# Altium schematic sheet digital_PIN_interface.SchDoc (part 1 of 2)
size C portrait; SheetNumber: 2; SheetTotal: 2
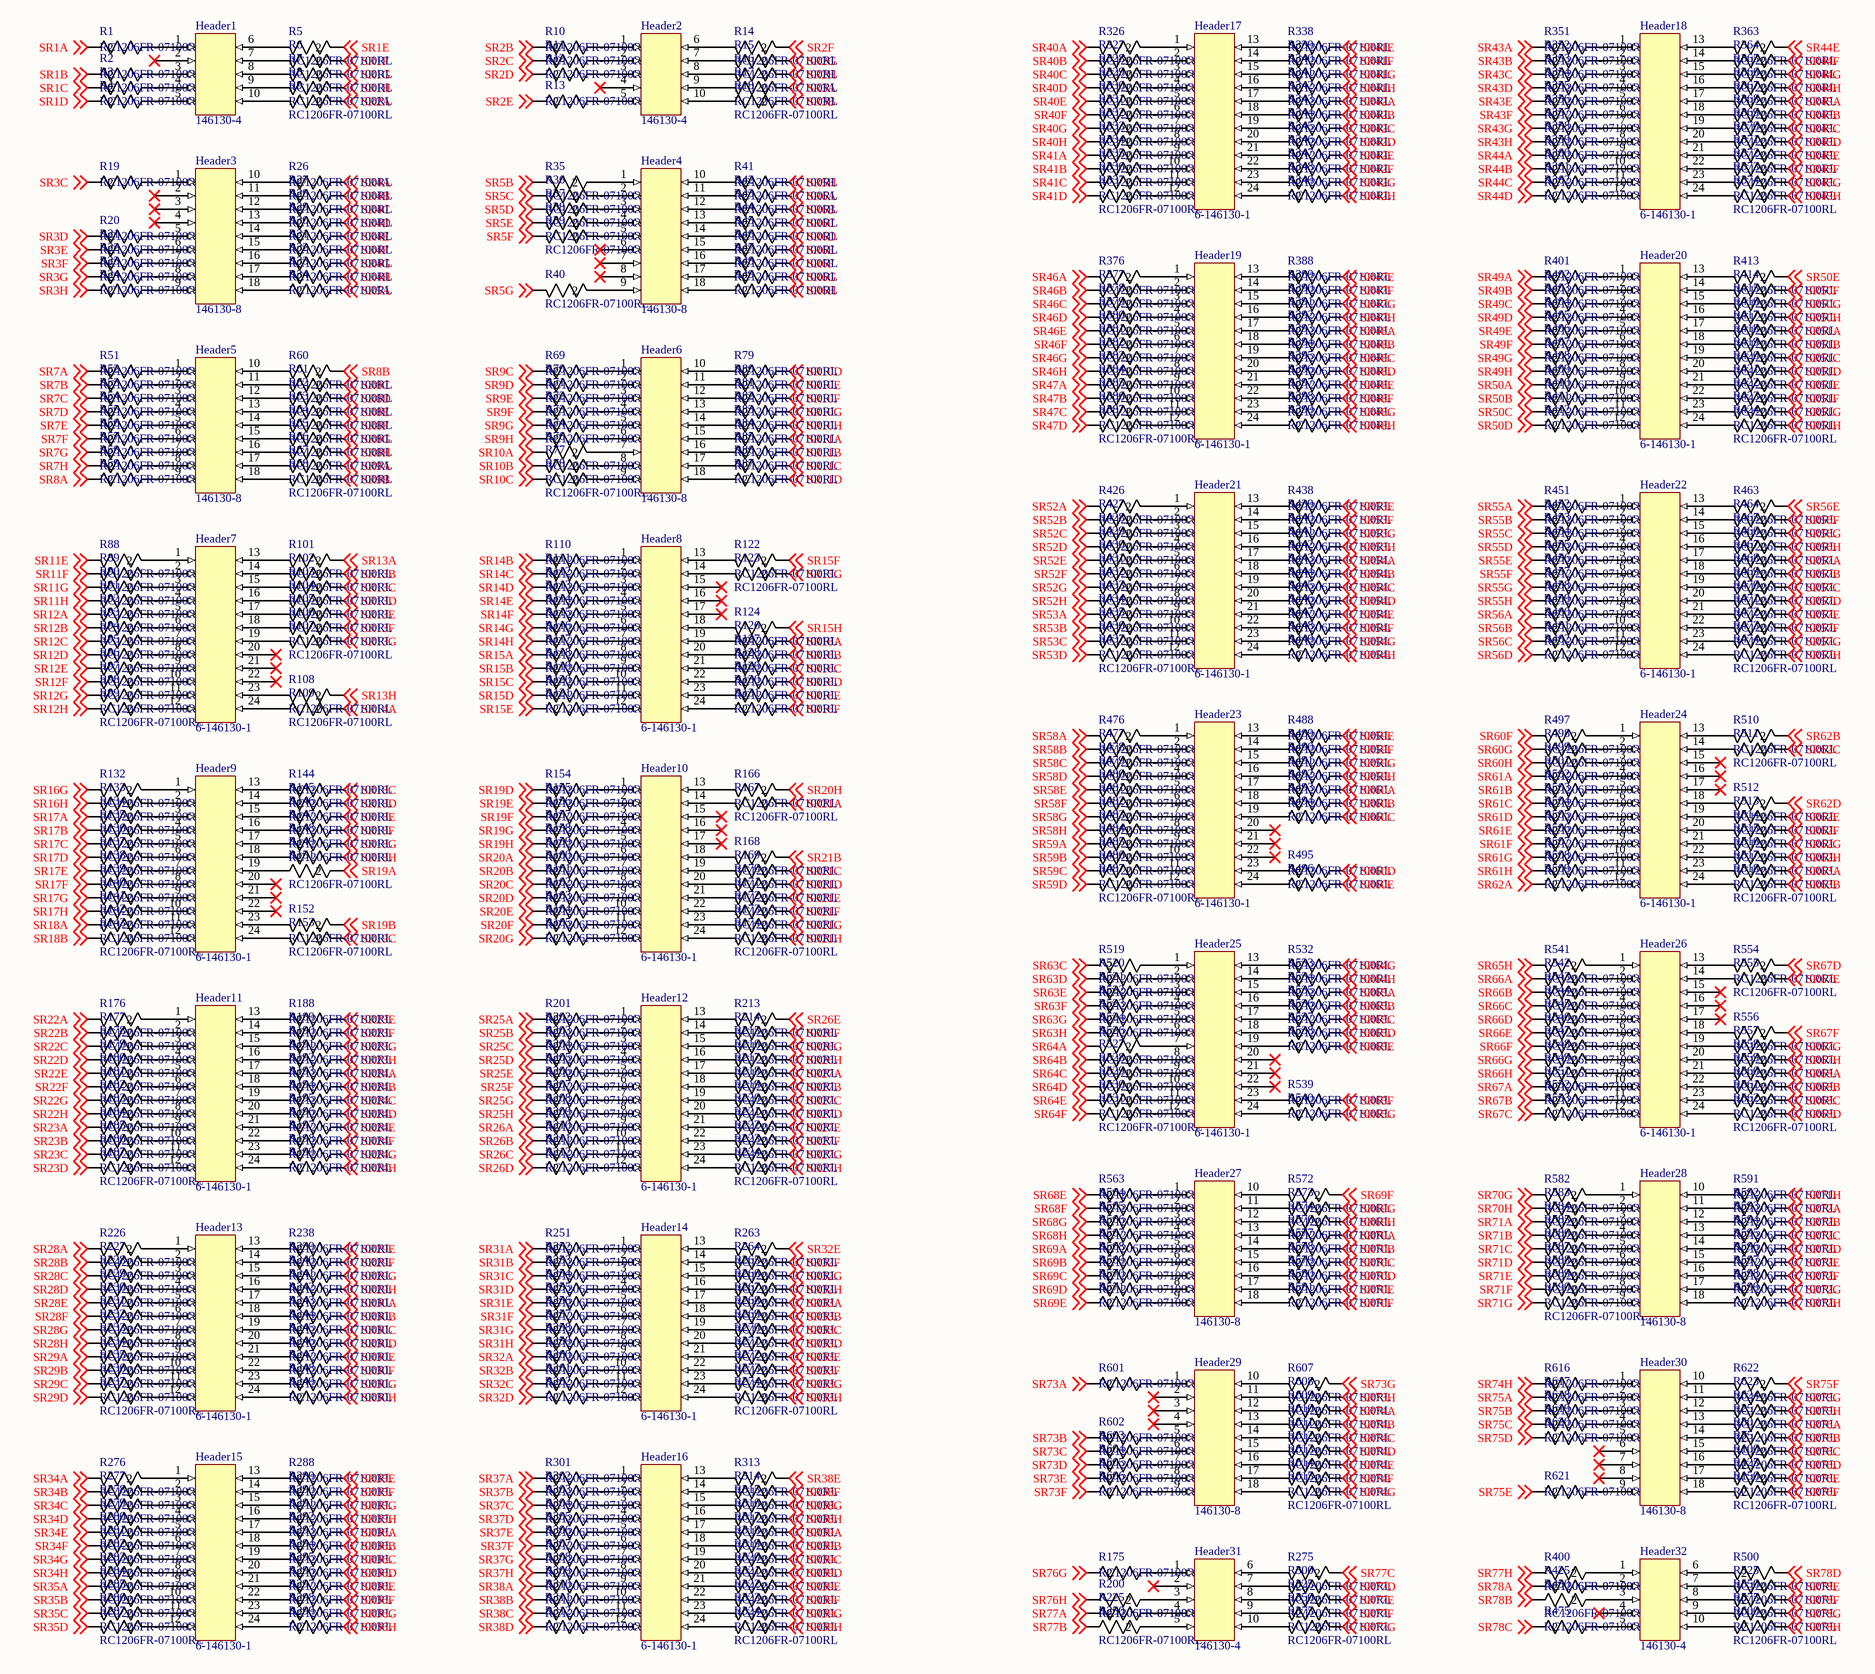
[diagram p0: digital_PIN_interface.SchDoc]

## Parts
Header1  146130-4  [CONN_5-146130-7_TYCO - duplicate - duplicate - duplicate]
Header2  146130-4  [CONN_5-146130-7_TYCO - duplicate - duplicate - duplicate]
Header3  146130-8  [CONN_5-146130-7_TYCO - duplicate - duplicate]
Header4  146130-8  [CONN_5-146130-7_TYCO - duplicate - duplicate]
Header5  146130-8  [CONN_5-146130-7_TYCO - duplicate - duplicate]
Header6  146130-8  [CONN_5-146130-7_TYCO - duplicate - duplicate]
Header7  6-146130-1  [CONN_5-146130-7_TYCO - duplicate]
Header8  6-146130-1  [CONN_5-146130-7_TYCO - duplicate]
Header9  6-146130-1  [CONN_5-146130-7_TYCO - duplicate]
Header10  6-146130-1  [CONN_5-146130-7_TYCO - duplicate]
Header11  6-146130-1  [CONN_5-146130-7_TYCO - duplicate]
Header12  6-146130-1  [CONN_5-146130-7_TYCO - duplicate]
Header13  6-146130-1  [CONN_5-146130-7_TYCO - duplicate]
Header14  6-146130-1  [CONN_5-146130-7_TYCO - duplicate]
Header15  6-146130-1  [CONN_5-146130-7_TYCO - duplicate]
Header16  6-146130-1  [CONN_5-146130-7_TYCO - duplicate]
Header17  6-146130-1  [CONN_5-146130-7_TYCO - duplicate]
Header18  6-146130-1  [CONN_5-146130-7_TYCO - duplicate]
Header19  6-146130-1  [CONN_5-146130-7_TYCO - duplicate]
Header20  6-146130-1  [CONN_5-146130-7_TYCO - duplicate]
Header21  6-146130-1  [CONN_5-146130-7_TYCO - duplicate]
Header22  6-146130-1  [CONN_5-146130-7_TYCO - duplicate]
Header23  6-146130-1  [CONN_5-146130-7_TYCO - duplicate]
Header24  6-146130-1  [CONN_5-146130-7_TYCO - duplicate]
Header25  6-146130-1  [CONN_5-146130-7_TYCO - duplicate]
Header26  6-146130-1  [CONN_5-146130-7_TYCO - duplicate]
Header27  146130-8  [CONN_5-146130-7_TYCO - duplicate - duplicate]
Header28  146130-8  [CONN_5-146130-7_TYCO - duplicate - duplicate]
Header29  146130-8  [CONN_5-146130-7_TYCO - duplicate - duplicate]
Header30  146130-8  [CONN_5-146130-7_TYCO - duplicate - duplicate]
Header31  146130-4  [CONN_5-146130-7_TYCO - duplicate - duplicate - duplicate]
Header32  146130-4  [CONN_5-146130-7_TYCO - duplicate - duplicate - duplicate]
R1  RC1206FR-07100RL  [RC1206N_YAG]
R2  RC1206FR-07100RL  [RC1206N_YAG]
R3  RC1206FR-07100RL  [RC1206N_YAG]
R4  RC1206FR-07100RL  [RC1206N_YAG]
R5  RC1206FR-07100RL  [RC1206N_YAG]
R6  RC1206FR-07100RL  [RC1206N_YAG]
R7  RC1206FR-07100RL  [RC1206N_YAG]
R8  RC1206FR-07100RL  [RC1206N_YAG]
R9  RC1206FR-07100RL  [RC1206N_YAG]
R10  RC1206FR-07100RL  [RC1206N_YAG]
R11  RC1206FR-07100RL  [RC1206N_YAG]
R12  RC1206FR-07100RL  [RC1206N_YAG]
R13  RC1206FR-07100RL  [RC1206N_YAG]
R14  RC1206FR-07100RL  [RC1206N_YAG]
R15  RC1206FR-07100RL  [RC1206N_YAG]
R16  RC1206FR-07100RL  [RC1206N_YAG]
R17  RC1206FR-07100RL  [RC1206N_YAG]
R18  RC1206FR-07100RL  [RC1206N_YAG]
R19  RC1206FR-07100RL  [RC1206N_YAG]
R20  RC1206FR-07100RL  [RC1206N_YAG]
R21  RC1206FR-07100RL  [RC1206N_YAG]
R22  RC1206FR-07100RL  [RC1206N_YAG]
R23  RC1206FR-07100RL  [RC1206N_YAG]
R24  RC1206FR-07100RL  [RC1206N_YAG]
R25  RC1206FR-07100RL  [RC1206N_YAG]
R26  RC1206FR-07100RL  [RC1206N_YAG]
R27  RC1206FR-07100RL  [RC1206N_YAG]
R28  RC1206FR-07100RL  [RC1206N_YAG]
R29  RC1206FR-07100RL  [RC1206N_YAG]
R30  RC1206FR-07100RL  [RC1206N_YAG]
R31  RC1206FR-07100RL  [RC1206N_YAG]
R32  RC1206FR-07100RL  [RC1206N_YAG]
R33  RC1206FR-07100RL  [RC1206N_YAG]
R34  RC1206FR-07100RL  [RC1206N_YAG]
R35  RC1206FR-07100RL  [RC1206N_YAG]
R36  RC1206FR-07100RL  [RC1206N_YAG]
R37  RC1206FR-07100RL  [RC1206N_YAG]
R38  RC1206FR-07100RL  [RC1206N_YAG]
R39  RC1206FR-07100RL  [RC1206N_YAG]
R40  RC1206FR-07100RL  [RC1206N_YAG]
R41  RC1206FR-07100RL  [RC1206N_YAG]
R42  RC1206FR-07100RL  [RC1206N_YAG]
R43  RC1206FR-07100RL  [RC1206N_YAG]
R44  RC1206FR-07100RL  [RC1206N_YAG]
R45  RC1206FR-07100RL  [RC1206N_YAG]
R46  RC1206FR-07100RL  [RC1206N_YAG]
R47  RC1206FR-07100RL  [RC1206N_YAG]
R48  RC1206FR-07100RL  [RC1206N_YAG]
R49  RC1206FR-07100RL  [RC1206N_YAG]
R50  RC1206FR-07100RL  [RC1206N_YAG]
R51  RC1206FR-07100RL  [RC1206N_YAG]
R52  RC1206FR-07100RL  [RC1206N_YAG]
R53  RC1206FR-07100RL  [RC1206N_YAG]
R54  RC1206FR-07100RL  [RC1206N_YAG]
R55  RC1206FR-07100RL  [RC1206N_YAG]
R56  RC1206FR-07100RL  [RC1206N_YAG]
R57  RC1206FR-07100RL  [RC1206N_YAG]
R58  RC1206FR-07100RL  [RC1206N_YAG]
R59  RC1206FR-07100RL  [RC1206N_YAG]
R60  RC1206FR-07100RL  [RC1206N_YAG]
R61  RC1206FR-07100RL  [RC1206N_YAG]
R62  RC1206FR-07100RL  [RC1206N_YAG]
R63  RC1206FR-07100RL  [RC1206N_YAG]
R64  RC1206FR-07100RL  [RC1206N_YAG]
R65  RC1206FR-07100RL  [RC1206N_YAG]
R66  RC1206FR-07100RL  [RC1206N_YAG]
R67  RC1206FR-07100RL  [RC1206N_YAG]
R68  RC1206FR-07100RL  [RC1206N_YAG]
R69  RC1206FR-07100RL  [RC1206N_YAG]
R70  RC1206FR-07100RL  [RC1206N_YAG]
R71  RC1206FR-07100RL  [RC1206N_YAG]
R72  RC1206FR-07100RL  [RC1206N_YAG]
R73  RC1206FR-07100RL  [RC1206N_YAG]
R74  RC1206FR-07100RL  [RC1206N_YAG]
R75  RC1206FR-07100RL  [RC1206N_YAG]
R76  RC1206FR-07100RL  [RC1206N_YAG]
R77  RC1206FR-07100RL  [RC1206N_YAG]
R78  RC1206FR-07100RL  [RC1206N_YAG]
R79  RC1206FR-07100RL  [RC1206N_YAG]
R80  RC1206FR-07100RL  [RC1206N_YAG]
R81  RC1206FR-07100RL  [RC1206N_YAG]
R82  RC1206FR-07100RL  [RC1206N_YAG]
R83  RC1206FR-07100RL  [RC1206N_YAG]
R84  RC1206FR-07100RL  [RC1206N_YAG]
R85  RC1206FR-07100RL  [RC1206N_YAG]
R86  RC1206FR-07100RL  [RC1206N_YAG]
R87  RC1206FR-07100RL  [RC1206N_YAG]
R88  RC1206FR-07100RL  [RC1206N_YAG]
R89  RC1206FR-07100RL  [RC1206N_YAG]
R90  RC1206FR-07100RL  [RC1206N_YAG]
R91  RC1206FR-07100RL  [RC1206N_YAG]
R92  RC1206FR-07100RL  [RC1206N_YAG]
R93  RC1206FR-07100RL  [RC1206N_YAG]
R94  RC1206FR-07100RL  [RC1206N_YAG]
R95  RC1206FR-07100RL  [RC1206N_YAG]
R96  RC1206FR-07100RL  [RC1206N_YAG]
R97  RC1206FR-07100RL  [RC1206N_YAG]
R98  RC1206FR-07100RL  [RC1206N_YAG]
R99  RC1206FR-07100RL  [RC1206N_YAG]
R100  RC1206FR-07100RL  [RC1206N_YAG]
R101  RC1206FR-07100RL  [RC1206N_YAG]
R102  RC1206FR-07100RL  [RC1206N_YAG]
R103  RC1206FR-07100RL  [RC1206N_YAG]
R104  RC1206FR-07100RL  [RC1206N_YAG]
R105  RC1206FR-07100RL  [RC1206N_YAG]
R106  RC1206FR-07100RL  [RC1206N_YAG]
R107  RC1206FR-07100RL  [RC1206N_YAG]
R108  RC1206FR-07100RL  [RC1206N_YAG]
R109  RC1206FR-07100RL  [RC1206N_YAG]
R110  RC1206FR-07100RL  [RC1206N_YAG]
R111  RC1206FR-07100RL  [RC1206N_YAG]
R112  RC1206FR-07100RL  [RC1206N_YAG]
R113  RC1206FR-07100RL  [RC1206N_YAG]
R114  RC1206FR-07100RL  [RC1206N_YAG]
R115  RC1206FR-07100RL  [RC1206N_YAG]
R116  RC1206FR-07100RL  [RC1206N_YAG]
R117  RC1206FR-07100RL  [RC1206N_YAG]
R118  RC1206FR-07100RL  [RC1206N_YAG]
R119  RC1206FR-07100RL  [RC1206N_YAG]
R120  RC1206FR-07100RL  [RC1206N_YAG]
R121  RC1206FR-07100RL  [RC1206N_YAG]
R122  RC1206FR-07100RL  [RC1206N_YAG]
R123  RC1206FR-07100RL  [RC1206N_YAG]
R124  RC1206FR-07100RL  [RC1206N_YAG]
R125  RC1206FR-07100RL  [RC1206N_YAG]
R126  RC1206FR-07100RL  [RC1206N_YAG]
R127  RC1206FR-07100RL  [RC1206N_YAG]
R128  RC1206FR-07100RL  [RC1206N_YAG]
R129  RC1206FR-07100RL  [RC1206N_YAG]
R130  RC1206FR-07100RL  [RC1206N_YAG]
R131  RC1206FR-07100RL  [RC1206N_YAG]
R132  RC1206FR-07100RL  [RC1206N_YAG]
R133  RC1206FR-07100RL  [RC1206N_YAG]
R134  RC1206FR-07100RL  [RC1206N_YAG]
R135  RC1206FR-07100RL  [RC1206N_YAG]
R136  RC1206FR-07100RL  [RC1206N_YAG]
R137  RC1206FR-07100RL  [RC1206N_YAG]
R138  RC1206FR-07100RL  [RC1206N_YAG]
R139  RC1206FR-07100RL  [RC1206N_YAG]
R140  RC1206FR-07100RL  [RC1206N_YAG]
R141  RC1206FR-07100RL  [RC1206N_YAG]
R142  RC1206FR-07100RL  [RC1206N_YAG]
R143  RC1206FR-07100RL  [RC1206N_YAG]
R144  RC1206FR-07100RL  [RC1206N_YAG]
R145  RC1206FR-07100RL  [RC1206N_YAG]
R146  RC1206FR-07100RL  [RC1206N_YAG]
R147  RC1206FR-07100RL  [RC1206N_YAG]
R148  RC1206FR-07100RL  [RC1206N_YAG]
R149  RC1206FR-07100RL  [RC1206N_YAG]
R150  RC1206FR-07100RL  [RC1206N_YAG]
R151  RC1206FR-07100RL  [RC1206N_YAG]
R152  RC1206FR-07100RL  [RC1206N_YAG]
R153  RC1206FR-07100RL  [RC1206N_YAG]
R154  RC1206FR-07100RL  [RC1206N_YAG]
R155  RC1206FR-07100RL  [RC1206N_YAG]
R156  RC1206FR-07100RL  [RC1206N_YAG]
R157  RC1206FR-07100RL  [RC1206N_YAG]
R158  RC1206FR-07100RL  [RC1206N_YAG]
R159  RC1206FR-07100RL  [RC1206N_YAG]
R160  RC1206FR-07100RL  [RC1206N_YAG]
R161  RC1206FR-07100RL  [RC1206N_YAG]
R162  RC1206FR-07100RL  [RC1206N_YAG]
R163  RC1206FR-07100RL  [RC1206N_YAG]
R164  RC1206FR-07100RL  [RC1206N_YAG]
R165  RC1206FR-07100RL  [RC1206N_YAG]
R166  RC1206FR-07100RL  [RC1206N_YAG]
R167  RC1206FR-07100RL  [RC1206N_YAG]
R168  RC1206FR-07100RL  [RC1206N_YAG]
R169  RC1206FR-07100RL  [RC1206N_YAG]
R170  RC1206FR-07100RL  [RC1206N_YAG]
R171  RC1206FR-07100RL  [RC1206N_YAG]
R172  RC1206FR-07100RL  [RC1206N_YAG]
R173  RC1206FR-07100RL  [RC1206N_YAG]
R174  RC1206FR-07100RL  [RC1206N_YAG]
R175  RC1206FR-07100RL  [RC1206N_YAG]
R176  RC1206FR-07100RL  [RC1206N_YAG]
R177  RC1206FR-07100RL  [RC1206N_YAG]
R178  RC1206FR-07100RL  [RC1206N_YAG]
R179  RC1206FR-07100RL  [RC1206N_YAG]
R180  RC1206FR-07100RL  [RC1206N_YAG]
R181  RC1206FR-07100RL  [RC1206N_YAG]
R182  RC1206FR-07100RL  [RC1206N_YAG]
R183  RC1206FR-07100RL  [RC1206N_YAG]
R184  RC1206FR-07100RL  [RC1206N_YAG]
R185  RC1206FR-07100RL  [RC1206N_YAG]
R186  RC1206FR-07100RL  [RC1206N_YAG]
R187  RC1206FR-07100RL  [RC1206N_YAG]
R188  RC1206FR-07100RL  [RC1206N_YAG]
R189  RC1206FR-07100RL  [RC1206N_YAG]
R190  RC1206FR-07100RL  [RC1206N_YAG]
R191  RC1206FR-07100RL  [RC1206N_YAG]
R192  RC1206FR-07100RL  [RC1206N_YAG]
R193  RC1206FR-07100RL  [RC1206N_YAG]
R194  RC1206FR-07100RL  [RC1206N_YAG]
R195  RC1206FR-07100RL  [RC1206N_YAG]
R196  RC1206FR-07100RL  [RC1206N_YAG]
R197  RC1206FR-07100RL  [RC1206N_YAG]
R198  RC1206FR-07100RL  [RC1206N_YAG]
R199  RC1206FR-07100RL  [RC1206N_YAG]
R200  RC1206FR-07100RL  [RC1206N_YAG]
R201  RC1206FR-07100RL  [RC1206N_YAG]
R202  RC1206FR-07100RL  [RC1206N_YAG]
R203  RC1206FR-07100RL  [RC1206N_YAG]
R204  RC1206FR-07100RL  [RC1206N_YAG]
R205  RC1206FR-07100RL  [RC1206N_YAG]
R206  RC1206FR-07100RL  [RC1206N_YAG]
R207  RC1206FR-07100RL  [RC1206N_YAG]
R208  RC1206FR-07100RL  [RC1206N_YAG]
R209  RC1206FR-07100RL  [RC1206N_YAG]
R210  RC1206FR-07100RL  [RC1206N_YAG]
R211  RC1206FR-07100RL  [RC1206N_YAG]
R212  RC1206FR-07100RL  [RC1206N_YAG]
R213  RC1206FR-07100RL  [RC1206N_YAG]
R214  RC1206FR-07100RL  [RC1206N_YAG]
R215  RC1206FR-07100RL  [RC1206N_YAG]
R216  RC1206FR-07100RL  [RC1206N_YAG]
R217  RC1206FR-07100RL  [RC1206N_YAG]
R218  RC1206FR-07100RL  [RC1206N_YAG]
R219  RC1206FR-07100RL  [RC1206N_YAG]
R220  RC1206FR-07100RL  [RC1206N_YAG]
R221  RC1206FR-07100RL  [RC1206N_YAG]
R222  RC1206FR-07100RL  [RC1206N_YAG]
R223  RC1206FR-07100RL  [RC1206N_YAG]
R224  RC1206FR-07100RL  [RC1206N_YAG]
R225  RC1206FR-07100RL  [RC1206N_YAG]
R226  RC1206FR-07100RL  [RC1206N_YAG]
R227  RC1206FR-07100RL  [RC1206N_YAG]
R228  RC1206FR-07100RL  [RC1206N_YAG]
R229  RC1206FR-07100RL  [RC1206N_YAG]
R230  RC1206FR-07100RL  [RC1206N_YAG]
R231  RC1206FR-07100RL  [RC1206N_YAG]
R232  RC1206FR-07100RL  [RC1206N_YAG]
R233  RC1206FR-07100RL  [RC1206N_YAG]
R234  RC1206FR-07100RL  [RC1206N_YAG]
R235  RC1206FR-07100RL  [RC1206N_YAG]
R236  RC1206FR-07100RL  [RC1206N_YAG]
R237  RC1206FR-07100RL  [RC1206N_YAG]
R238  RC1206FR-07100RL  [RC1206N_YAG]
R239  RC1206FR-07100RL  [RC1206N_YAG]
R240  RC1206FR-07100RL  [RC1206N_YAG]
R241  RC1206FR-07100RL  [RC1206N_YAG]
R242  RC1206FR-07100RL  [RC1206N_YAG]
R243  RC1206FR-07100RL  [RC1206N_YAG]
R244  RC1206FR-07100RL  [RC1206N_YAG]
R245  RC1206FR-07100RL  [RC1206N_YAG]
R246  RC1206FR-07100RL  [RC1206N_YAG]
R247  RC1206FR-07100RL  [RC1206N_YAG]
R248  RC1206FR-07100RL  [RC1206N_YAG]
R249  RC1206FR-07100RL  [RC1206N_YAG]
R250  RC1206FR-07100RL  [RC1206N_YAG]
R251  RC1206FR-07100RL  [RC1206N_YAG]
R252  RC1206FR-07100RL  [RC1206N_YAG]
R253  RC1206FR-07100RL  [RC1206N_YAG]
R254  RC1206FR-07100RL  [RC1206N_YAG]
R255  RC1206FR-07100RL  [RC1206N_YAG]
R256  RC1206FR-07100RL  [RC1206N_YAG]
R257  RC1206FR-07100RL  [RC1206N_YAG]
R258  RC1206FR-07100RL  [RC1206N_YAG]
R259  RC1206FR-07100RL  [RC1206N_YAG]
R260  RC1206FR-07100RL  [RC1206N_YAG]
R261  RC1206FR-07100RL  [RC1206N_YAG]
R262  RC1206FR-07100RL  [RC1206N_YAG]
R263  RC1206FR-07100RL  [RC1206N_YAG]
R264  RC1206FR-07100RL  [RC1206N_YAG]
R265  RC1206FR-07100RL  [RC1206N_YAG]
R266  RC1206FR-07100RL  [RC1206N_YAG]
R267  RC1206FR-07100RL  [RC1206N_YAG]
R268  RC1206FR-07100RL  [RC1206N_YAG]
R269  RC1206FR-07100RL  [RC1206N_YAG]
R270  RC1206FR-07100RL  [RC1206N_YAG]
R271  RC1206FR-07100RL  [RC1206N_YAG]
R272  RC1206FR-07100RL  [RC1206N_YAG]
R273  RC1206FR-07100RL  [RC1206N_YAG]
R274  RC1206FR-07100RL  [RC1206N_YAG]
R275  RC1206FR-07100RL  [RC1206N_YAG]
R276  RC1206FR-07100RL  [RC1206N_YAG]
R277  RC1206FR-07100RL  [RC1206N_YAG]
R278  RC1206FR-07100RL  [RC1206N_YAG]
R279  RC1206FR-07100RL  [RC1206N_YAG]
R280  RC1206FR-07100RL  [RC1206N_YAG]
R281  RC1206FR-07100RL  [RC1206N_YAG]
R282  RC1206FR-07100RL  [RC1206N_YAG]
R283  RC1206FR-07100RL  [RC1206N_YAG]
R284  RC1206FR-07100RL  [RC1206N_YAG]
R285  RC1206FR-07100RL  [RC1206N_YAG]
R286  RC1206FR-07100RL  [RC1206N_YAG]
R287  RC1206FR-07100RL  [RC1206N_YAG]
R288  RC1206FR-07100RL  [RC1206N_YAG]
R289  RC1206FR-07100RL  [RC1206N_YAG]
R290  RC1206FR-07100RL  [RC1206N_YAG]
R291  RC1206FR-07100RL  [RC1206N_YAG]
R292  RC1206FR-07100RL  [RC1206N_YAG]
R293  RC1206FR-07100RL  [RC1206N_YAG]
R294  RC1206FR-07100RL  [RC1206N_YAG]
R295  RC1206FR-07100RL  [RC1206N_YAG]
R296  RC1206FR-07100RL  [RC1206N_YAG]
R297  RC1206FR-07100RL  [RC1206N_YAG]
R298  RC1206FR-07100RL  [RC1206N_YAG]
R299  RC1206FR-07100RL  [RC1206N_YAG]
R300  RC1206FR-07100RL  [RC1206N_YAG]
R301  RC1206FR-07100RL  [RC1206N_YAG]
R302  RC1206FR-07100RL  [RC1206N_YAG]
R303  RC1206FR-07100RL  [RC1206N_YAG]
R304  RC1206FR-07100RL  [RC1206N_YAG]
R305  RC1206FR-07100RL  [RC1206N_YAG]
R306  RC1206FR-07100RL  [RC1206N_YAG]
R307  RC1206FR-07100RL  [RC1206N_YAG]
R308  RC1206FR-07100RL  [RC1206N_YAG]
R309  RC1206FR-07100RL  [RC1206N_YAG]
R310  RC1206FR-07100RL  [RC1206N_YAG]
R311  RC1206FR-07100RL  [RC1206N_YAG]
R312  RC1206FR-07100RL  [RC1206N_YAG]
R313  RC1206FR-07100RL  [RC1206N_YAG]
R314  RC1206FR-07100RL  [RC1206N_YAG]
R315  RC1206FR-07100RL  [RC1206N_YAG]
R316  RC1206FR-07100RL  [RC1206N_YAG]
R317  RC1206FR-07100RL  [RC1206N_YAG]
R318  RC1206FR-07100RL  [RC1206N_YAG]
R319  RC1206FR-07100RL  [RC1206N_YAG]
R320  RC1206FR-07100RL  [RC1206N_YAG]
R321  RC1206FR-07100RL  [RC1206N_YAG]
R322  RC1206FR-07100RL  [RC1206N_YAG]
R323  RC1206FR-07100RL  [RC1206N_YAG]
R324  RC1206FR-07100RL  [RC1206N_YAG]
R325  RC1206FR-07100RL  [RC1206N_YAG]
R326  RC1206FR-07100RL  [RC1206N_YAG]
R327  RC1206FR-07100RL  [RC1206N_YAG]
R328  RC1206FR-07100RL  [RC1206N_YAG]
R329  RC1206FR-07100RL  [RC1206N_YAG]
R330  RC1206FR-07100RL  [RC1206N_YAG]
R331  RC1206FR-07100RL  [RC1206N_YAG]
R332  RC1206FR-07100RL  [RC1206N_YAG]
R333  RC1206FR-07100RL  [RC1206N_YAG]
R334  RC1206FR-07100RL  [RC1206N_YAG]
R335  RC1206FR-07100RL  [RC1206N_YAG]
R336  RC1206FR-07100RL  [RC1206N_YAG]
R337  RC1206FR-07100RL  [RC1206N_YAG]
R338  RC1206FR-07100RL  [RC1206N_YAG]
R339  RC1206FR-07100RL  [RC1206N_YAG]
R340  RC1206FR-07100RL  [RC1206N_YAG]
R341  RC1206FR-07100RL  [RC1206N_YAG]
R342  RC1206FR-07100RL  [RC1206N_YAG]
R343  RC1206FR-07100RL  [RC1206N_YAG]
R344  RC1206FR-07100RL  [RC1206N_YAG]
R345  RC1206FR-07100RL  [RC1206N_YAG]
R346  RC1206FR-07100RL  [RC1206N_YAG]
R347  RC1206FR-07100RL  [RC1206N_YAG]
R348  RC1206FR-07100RL  [RC1206N_YAG]
R349  RC1206FR-07100RL  [RC1206N_YAG]
R350  RC1206FR-07100RL  [RC1206N_YAG]
R351  RC1206FR-07100RL  [RC1206N_YAG]
R352  RC1206FR-07100RL  [RC1206N_YAG]
R353  RC1206FR-07100RL  [RC1206N_YAG]
R354  RC1206FR-07100RL  [RC1206N_YAG]
R355  RC1206FR-07100RL  [RC1206N_YAG]
R356  RC1206FR-07100RL  [RC1206N_YAG]
R357  RC1206FR-07100RL  [RC1206N_YAG]
R358  RC1206FR-07100RL  [RC1206N_YAG]
R359  RC1206FR-07100RL  [RC1206N_YAG]
R360  RC1206FR-07100RL  [RC1206N_YAG]
R361  RC1206FR-07100RL  [RC1206N_YAG]
R362  RC1206FR-07100RL  [RC1206N_YAG]
R363  RC1206FR-07100RL  [RC1206N_YAG]
R364  RC1206FR-07100RL  [RC1206N_YAG]
R365  RC1206FR-07100RL  [RC1206N_YAG]
R366  RC1206FR-07100RL  [RC1206N_YAG]
R367  RC1206FR-07100RL  [RC1206N_YAG]
R368  RC1206FR-07100RL  [RC1206N_YAG]
R369  RC1206FR-07100RL  [RC1206N_YAG]
R370  RC1206FR-07100RL  [RC1206N_YAG]
R371  RC1206FR-07100RL  [RC1206N_YAG]
R372  RC1206FR-07100RL  [RC1206N_YAG]
R373  RC1206FR-07100RL  [RC1206N_YAG]
R374  RC1206FR-07100RL  [RC1206N_YAG]
R375  RC1206FR-07100RL  [RC1206N_YAG]
R376  RC1206FR-07100RL  [RC1206N_YAG]
R377  RC1206FR-07100RL  [RC1206N_YAG]
R378  RC1206FR-07100RL  [RC1206N_YAG]
R379  RC1206FR-07100RL  [RC1206N_YAG]
R380  RC1206FR-07100RL  [RC1206N_YAG]
R381  RC1206FR-07100RL  [RC1206N_YAG]
R382  RC1206FR-07100RL  [RC1206N_YAG]
R383  RC1206FR-07100RL  [RC1206N_YAG]
R384  RC1206FR-07100RL  [RC1206N_YAG]
R385  RC1206FR-07100RL  [RC1206N_YAG]
R386  RC1206FR-07100RL  [RC1206N_YAG]
R387  RC1206FR-07100RL  [RC1206N_YAG]
R388  RC1206FR-07100RL  [RC1206N_YAG]
R389  RC1206FR-07100RL  [RC1206N_YAG]
R390  RC1206FR-07100RL  [RC1206N_YAG]
R391  RC1206FR-07100RL  [RC1206N_YAG]
R392  RC1206FR-07100RL  [RC1206N_YAG]
R393  RC1206FR-07100RL  [RC1206N_YAG]
R394  RC1206FR-07100RL  [RC1206N_YAG]
R395  RC1206FR-07100RL  [RC1206N_YAG]
R396  RC1206FR-07100RL  [RC1206N_YAG]
R397  RC1206FR-07100RL  [RC1206N_YAG]
R398  RC1206FR-07100RL  [RC1206N_YAG]
R399  RC1206FR-07100RL  [RC1206N_YAG]
R400  RC1206FR-07100RL  [RC1206N_YAG]
R401  RC1206FR-07100RL  [RC1206N_YAG]
R402  RC1206FR-07100RL  [RC1206N_YAG]
R403  RC1206FR-07100RL  [RC1206N_YAG]
R404  RC1206FR-07100RL  [RC1206N_YAG]
R405  RC1206FR-07100RL  [RC1206N_YAG]
R406  RC1206FR-07100RL  [RC1206N_YAG]
R407  RC1206FR-07100RL  [RC1206N_YAG]
R408  RC1206FR-07100RL  [RC1206N_YAG]
R409  RC1206FR-07100RL  [RC1206N_YAG]
R410  RC1206FR-07100RL  [RC1206N_YAG]
R411  RC1206FR-07100RL  [RC1206N_YAG]
R412  RC1206FR-07100RL  [RC1206N_YAG]
R413  RC1206FR-07100RL  [RC1206N_YAG]
R414  RC1206FR-07100RL  [RC1206N_YAG]
R415  RC1206FR-07100RL  [RC1206N_YAG]
R416  RC1206FR-07100RL  [RC1206N_YAG]
R417  RC1206FR-07100RL  [RC1206N_YAG]
R418  RC1206FR-07100RL  [RC1206N_YAG]
R419  RC1206FR-07100RL  [RC1206N_YAG]
R420  RC1206FR-07100RL  [RC1206N_YAG]
R421  RC1206FR-07100RL  [RC1206N_YAG]
R422  RC1206FR-07100RL  [RC1206N_YAG]
R423  RC1206FR-07100RL  [RC1206N_YAG]
R424  RC1206FR-07100RL  [RC1206N_YAG]
R425  RC1206FR-07100RL  [RC1206N_YAG]
R426  RC1206FR-07100RL  [RC1206N_YAG]
R427  RC1206FR-07100RL  [RC1206N_YAG]
R428  RC1206FR-07100RL  [RC1206N_YAG]
R429  RC1206FR-07100RL  [RC1206N_YAG]
R430  RC1206FR-07100RL  [RC1206N_YAG]
R431  RC1206FR-07100RL  [RC1206N_YAG]
R432  RC1206FR-07100RL  [RC1206N_YAG]
R433  RC1206FR-07100RL  [RC1206N_YAG]
R434  RC1206FR-07100RL  [RC1206N_YAG]
R435  RC1206FR-07100RL  [RC1206N_YAG]
R436  RC1206FR-07100RL  [RC1206N_YAG]
R437  RC1206FR-07100RL  [RC1206N_YAG]
R438  RC1206FR-07100RL  [RC1206N_YAG]
R439  RC1206FR-07100RL  [RC1206N_YAG]
R440  RC1206FR-07100RL  [RC1206N_YAG]
R441  RC1206FR-07100RL  [RC1206N_YAG]
R442  RC1206FR-07100RL  [RC1206N_YAG]
R443  RC1206FR-07100RL  [RC1206N_YAG]
R444  RC1206FR-07100RL  [RC1206N_YAG]
R445  RC1206FR-07100RL  [RC1206N_YAG]
R446  RC1206FR-07100RL  [RC1206N_YAG]
R447  RC1206FR-07100RL  [RC1206N_YAG]
R448  RC1206FR-07100RL  [RC1206N_YAG]
R449  RC1206FR-07100RL  [RC1206N_YAG]
R450  RC1206FR-07100RL  [RC1206N_YAG]
R451  RC1206FR-07100RL  [RC1206N_YAG]
R452  RC1206FR-07100RL  [RC1206N_YAG]
R453  RC1206FR-07100RL  [RC1206N_YAG]
R454  RC1206FR-07100RL  [RC1206N_YAG]
R455  RC1206FR-07100RL  [RC1206N_YAG]
R456  RC1206FR-07100RL  [RC1206N_YAG]
R457  RC1206FR-07100RL  [RC1206N_YAG]
R458  RC1206FR-07100RL  [RC1206N_YAG]
R459  RC1206FR-07100RL  [RC1206N_YAG]
R460  RC1206FR-07100RL  [RC1206N_YAG]
R461  RC1206FR-07100RL  [RC1206N_YAG]
R462  RC1206FR-07100RL  [RC1206N_YAG]
R463  RC1206FR-07100RL  [RC1206N_YAG]
R464  RC1206FR-07100RL  [RC1206N_YAG]
R465  RC1206FR-07100RL  [RC1206N_YAG]
R466  RC1206FR-07100RL  [RC1206N_YAG]
R467  RC1206FR-07100RL  [RC1206N_YAG]
R468  RC1206FR-07100RL  [RC1206N_YAG]
R469  RC1206FR-07100RL  [RC1206N_YAG]
R470  RC1206FR-07100RL  [RC1206N_YAG]
R471  RC1206FR-07100RL  [RC1206N_YAG]
R472  RC1206FR-07100RL  [RC1206N_YAG]
R473  RC1206FR-07100RL  [RC1206N_YAG]
R474  RC1206FR-07100RL  [RC1206N_YAG]
R475  RC1206FR-07100RL  [RC1206N_YAG]
R476  RC1206FR-07100RL  [RC1206N_YAG]
R477  RC1206FR-07100RL  [RC1206N_YAG]
R478  RC1206FR-07100RL  [RC1206N_YAG]
R479  RC1206FR-07100RL  [RC1206N_YAG]
R480  RC1206FR-07100RL  [RC1206N_YAG]
R481  RC1206FR-07100RL  [RC1206N_YAG]
R482  RC1206FR-07100RL  [RC1206N_YAG]
R483  RC1206FR-07100RL  [RC1206N_YAG]
R484  RC1206FR-07100RL  [RC1206N_YAG]
R485  RC1206FR-07100RL  [RC1206N_YAG]
R486  RC1206FR-07100RL  [RC1206N_YAG]
R487  RC1206FR-07100RL  [RC1206N_YAG]
R488  RC1206FR-07100RL  [RC1206N_YAG]
R489  RC1206FR-07100RL  [RC1206N_YAG]
R490  RC1206FR-07100RL  [RC1206N_YAG]
R491  RC1206FR-07100RL  [RC1206N_YAG]
R492  RC1206FR-07100RL  [RC1206N_YAG]
R493  RC1206FR-07100RL  [RC1206N_YAG]
R494  RC1206FR-07100RL  [RC1206N_YAG]
R495  RC1206FR-07100RL  [RC1206N_YAG]
R496  RC1206FR-07100RL  [RC1206N_YAG]
R497  RC1206FR-07100RL  [RC1206N_YAG]
R498  RC1206FR-07100RL  [RC1206N_YAG]
R499  RC1206FR-07100RL  [RC1206N_YAG]
R500  RC1206FR-07100RL  [RC1206N_YAG]
R501  RC1206FR-07100RL  [RC1206N_YAG]
R502  RC1206FR-07100RL  [RC1206N_YAG]
R503  RC1206FR-07100RL  [RC1206N_YAG]
R504  RC1206FR-07100RL  [RC1206N_YAG]
R505  RC1206FR-07100RL  [RC1206N_YAG]
R506  RC1206FR-07100RL  [RC1206N_YAG]
R507  RC1206FR-07100RL  [RC1206N_YAG]
R508  RC1206FR-07100RL  [RC1206N_YAG]
R509  RC1206FR-07100RL  [RC1206N_YAG]
R510  RC1206FR-07100RL  [RC1206N_YAG]
R511  RC1206FR-07100RL  [RC1206N_YAG]
R512  RC1206FR-07100RL  [RC1206N_YAG]
R513  RC1206FR-07100RL  [RC1206N_YAG]
R514  RC1206FR-07100RL  [RC1206N_YAG]
R515  RC1206FR-07100RL  [RC1206N_YAG]
R516  RC1206FR-07100RL  [RC1206N_YAG]
R517  RC1206FR-07100RL  [RC1206N_YAG]
R518  RC1206FR-07100RL  [RC1206N_YAG]
R519  RC1206FR-07100RL  [RC1206N_YAG]
R520  RC1206FR-07100RL  [RC1206N_YAG]
R521  RC1206FR-07100RL  [RC1206N_YAG]
R522  RC1206FR-07100RL  [RC1206N_YAG]
R523  RC1206FR-07100RL  [RC1206N_YAG]
R524  RC1206FR-07100RL  [RC1206N_YAG]
R525  RC1206FR-07100RL  [RC1206N_YAG]
R526  RC1206FR-07100RL  [RC1206N_YAG]
R527  RC1206FR-07100RL  [RC1206N_YAG]
R528  RC1206FR-07100RL  [RC1206N_YAG]
R529  RC1206FR-07100RL  [RC1206N_YAG]
R530  RC1206FR-07100RL  [RC1206N_YAG]
R531  RC1206FR-07100RL  [RC1206N_YAG]
R532  RC1206FR-07100RL  [RC1206N_YAG]
R533  RC1206FR-07100RL  [RC1206N_YAG]
R534  RC1206FR-07100RL  [RC1206N_YAG]
R535  RC1206FR-07100RL  [RC1206N_YAG]
R536  RC1206FR-07100RL  [RC1206N_YAG]
R537  RC1206FR-07100RL  [RC1206N_YAG]
R538  RC1206FR-07100RL  [RC1206N_YAG]
R539  RC1206FR-07100RL  [RC1206N_YAG]
R540  RC1206FR-07100RL  [RC1206N_YAG]
R541  RC1206FR-07100RL  [RC1206N_YAG]
R542  RC1206FR-07100RL  [RC1206N_YAG]
R543  RC1206FR-07100RL  [RC1206N_YAG]
R544  RC1206FR-07100RL  [RC1206N_YAG]
R545  RC1206FR-07100RL  [RC1206N_YAG]
R546  RC1206FR-07100RL  [RC1206N_YAG]
R547  RC1206FR-07100RL  [RC1206N_YAG]
R548  RC1206FR-07100RL  [RC1206N_YAG]
R549  RC1206FR-07100RL  [RC1206N_YAG]
R550  RC1206FR-07100RL  [RC1206N_YAG]
R551  RC1206FR-07100RL  [RC1206N_YAG]
R552  RC1206FR-07100RL  [RC1206N_YAG]
R553  RC1206FR-07100RL  [RC1206N_YAG]
R554  RC1206FR-07100RL  [RC1206N_YAG]
R555  RC1206FR-07100RL  [RC1206N_YAG]
R556  RC1206FR-07100RL  [RC1206N_YAG]
R557  RC1206FR-07100RL  [RC1206N_YAG]
R558  RC1206FR-07100RL  [RC1206N_YAG]
R559  RC1206FR-07100RL  [RC1206N_YAG]
R560  RC1206FR-07100RL  [RC1206N_YAG]
R561  RC1206FR-07100RL  [RC1206N_YAG]
R562  RC1206FR-07100RL  [RC1206N_YAG]
R563  RC1206FR-07100RL  [RC1206N_YAG]
R564  RC1206FR-07100RL  [RC1206N_YAG]
R565  RC1206FR-07100RL  [RC1206N_YAG]
R566  RC1206FR-07100RL  [RC1206N_YAG]
R567  RC1206FR-07100RL  [RC1206N_YAG]
R568  RC1206FR-07100RL  [RC1206N_YAG]
R569  RC1206FR-07100RL  [RC1206N_YAG]
R570  RC1206FR-07100RL  [RC1206N_YAG]
R571  RC1206FR-07100RL  [RC1206N_YAG]
R572  RC1206FR-07100RL  [RC1206N_YAG]
R573  RC1206FR-07100RL  [RC1206N_YAG]
R574  RC1206FR-07100RL  [RC1206N_YAG]
R575  RC1206FR-07100RL  [RC1206N_YAG]
R576  RC1206FR-07100RL  [RC1206N_YAG]
R577  RC1206FR-07100RL  [RC1206N_YAG]
R578  RC1206FR-07100RL  [RC1206N_YAG]
R579  RC1206FR-07100RL  [RC1206N_YAG]
R580  RC1206FR-07100RL  [RC1206N_YAG]
R581  RC1206FR-07100RL  [RC1206N_YAG]
R582  RC1206FR-07100RL  [RC1206N_YAG]
R583  RC1206FR-07100RL  [RC1206N_YAG]
R584  RC1206FR-07100RL  [RC1206N_YAG]
R585  RC1206FR-07100RL  [RC1206N_YAG]
R586  RC1206FR-07100RL  [RC1206N_YAG]
R587  RC1206FR-07100RL  [RC1206N_YAG]
R588  RC1206FR-07100RL  [RC1206N_YAG]
R589  RC1206FR-07100RL  [RC1206N_YAG]
R590  RC1206FR-07100RL  [RC1206N_YAG]
R591  RC1206FR-07100RL  [RC1206N_YAG]
R592  RC1206FR-07100RL  [RC1206N_YAG]
R593  RC1206FR-07100RL  [RC1206N_YAG]
R594  RC1206FR-07100RL  [RC1206N_YAG]
R595  RC1206FR-07100RL  [RC1206N_YAG]
R596  RC1206FR-07100RL  [RC1206N_YAG]
R597  RC1206FR-07100RL  [RC1206N_YAG]
R598  RC1206FR-07100RL  [RC1206N_YAG]
R599  RC1206FR-07100RL  [RC1206N_YAG]
R600  RC1206FR-07100RL  [RC1206N_YAG]
R601  RC1206FR-07100RL  [RC1206N_YAG]
R602  RC1206FR-07100RL  [RC1206N_YAG]
R603  RC1206FR-07100RL  [RC1206N_YAG]
R604  RC1206FR-07100RL  [RC1206N_YAG]
R605  RC1206FR-07100RL  [RC1206N_YAG]
R606  RC1206FR-07100RL  [RC1206N_YAG]
R607  RC1206FR-07100RL  [RC1206N_YAG]
R608  RC1206FR-07100RL  [RC1206N_YAG]
R609  RC1206FR-07100RL  [RC1206N_YAG]
R610  RC1206FR-07100RL  [RC1206N_YAG]
R611  RC1206FR-07100RL  [RC1206N_YAG]
R612  RC1206FR-07100RL  [RC1206N_YAG]
R613  RC1206FR-07100RL  [RC1206N_YAG]
R614  RC1206FR-07100RL  [RC1206N_YAG]
R615  RC1206FR-07100RL  [RC1206N_YAG]
R616  RC1206FR-07100RL  [RC1206N_YAG]
R617  RC1206FR-07100RL  [RC1206N_YAG]
R618  RC1206FR-07100RL  [RC1206N_YAG]
R619  RC1206FR-07100RL  [RC1206N_YAG]
R620  RC1206FR-07100RL  [RC1206N_YAG]
R621  RC1206FR-07100RL  [RC1206N_YAG]
R622  RC1206FR-07100RL  [RC1206N_YAG]
R623  RC1206FR-07100RL  [RC1206N_YAG]
R624  RC1206FR-07100RL  [RC1206N_YAG]